# EAGLE design M216X (EAGLE 4.11)
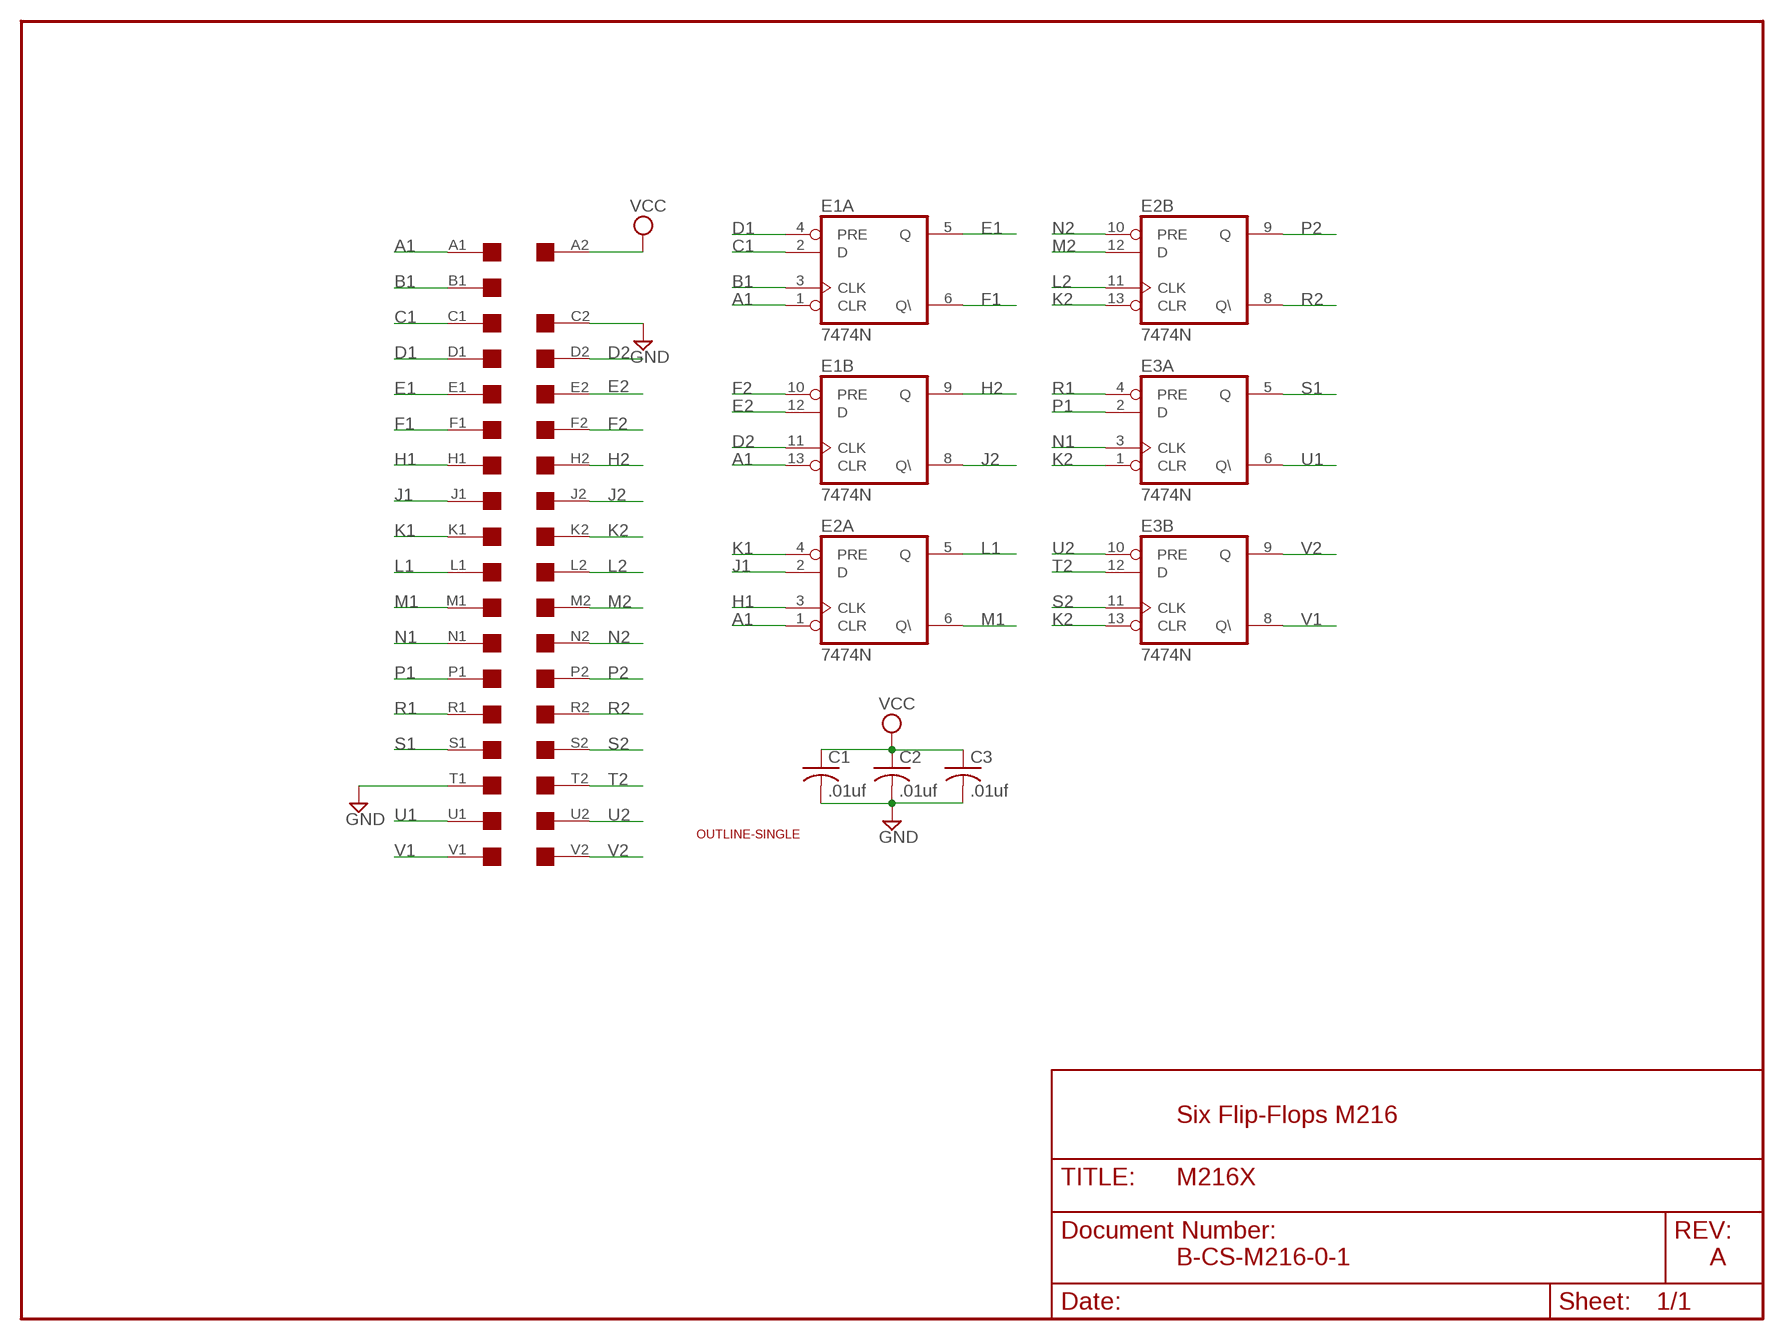
[diagram p0: schematic, sheet 1]

## Parts
C1  .01uf  C-US050-025X075  [C050-025X075]
C2  .01uf  C-US050-025X075  [C050-025X075]
C3  .01uf  C-US050-025X075  [C050-025X075]
E1  7474N  74S74N  [DIL14]
E2  7474N  74S74N  [DIL14]
E3  7474N  74S74N  [DIL14]
U$1  OUTLINE-SINGLE  [SINGLE]
U$4  SINGLE  [EDGE-CON2]

## Nets
A1: E1.1(A:CLR) E1.13(B:CLR) E2.1(A:CLR) U$4.A1
B1: E1.3(A:CLK) U$4.B1
C1: E1.2(A:D) U$4.C1
D1: E1.4(A:PRE) U$4.D1
D2: E1.11(B:CLK) U$4.D2
E1: E1.5(A:Q) U$4.E1
E2: E1.12(B:D) U$4.E2
F1: E1.6(A:Q\) U$4.F1
F2: E1.10(B:PRE) U$4.F2
GND [Supply]: C1.2 C2.2 C3.2 U$4.C2 U$4.T1
H1: E2.3(A:CLK) U$4.H1
H2: E1.9(B:Q) U$4.H2
J1: E2.2(A:D) U$4.J1
J2: E1.8(B:Q\) U$4.J2
K1: E2.4(A:PRE) U$4.K1
K2: E2.13(B:CLR) E3.1(A:CLR) E3.13(B:CLR) U$4.K2
L1: E2.5(A:Q) U$4.L1
L2: E2.11(B:CLK) U$4.L2
M1: E2.6(A:Q\) U$4.M1
M2: E2.12(B:D) U$4.M2
N1: E3.3(A:CLK) U$4.N1
N2: E2.10(B:PRE) U$4.N2
P1: E3.2(A:D) U$4.P1
P2: E2.9(B:Q) U$4.P2
R1: E3.4(A:PRE) U$4.R1
R2: E2.8(B:Q\) U$4.R2
S1: E3.5(A:Q) U$4.S1
S2: E3.11(B:CLK) U$4.S2
T2: E3.12(B:D) U$4.T2
U1: E3.6(A:Q\) U$4.U1
U2: E3.10(B:PRE) U$4.U2
V1: E3.8(B:Q\) U$4.V1
V2: E3.9(B:Q) U$4.V2
VCC [Supply]: C1.1 C2.1 C3.1 U$4.A2
Unconnected: U$4.B2

## Notes on the sheet
- Six Flip-Flops M216
- B-CS-M216-0-1 | A

## Power pins joined to a net without a drawn wire
GND: E1.7(P:GND) E2.7(P:GND) E3.7(P:GND)
VCC: E1.14(P:VCC) E2.14(P:VCC) E3.14(P:VCC)

## Library data of the parts
C1-C3 = rcl:C-US: CAPACITOR, American symbol
E1-E3 = 74xx-us:74*74: Dual D type positive edge triggered FLIP FLOP, preset and clear
U$1 = dec-con:OUTLINE-*: Board outlines for DEC boards.
U$4 = dec-con:SINGLE: Single-Height DEC board

## Net classes
1 Supply: width 0.813 mm

## Board
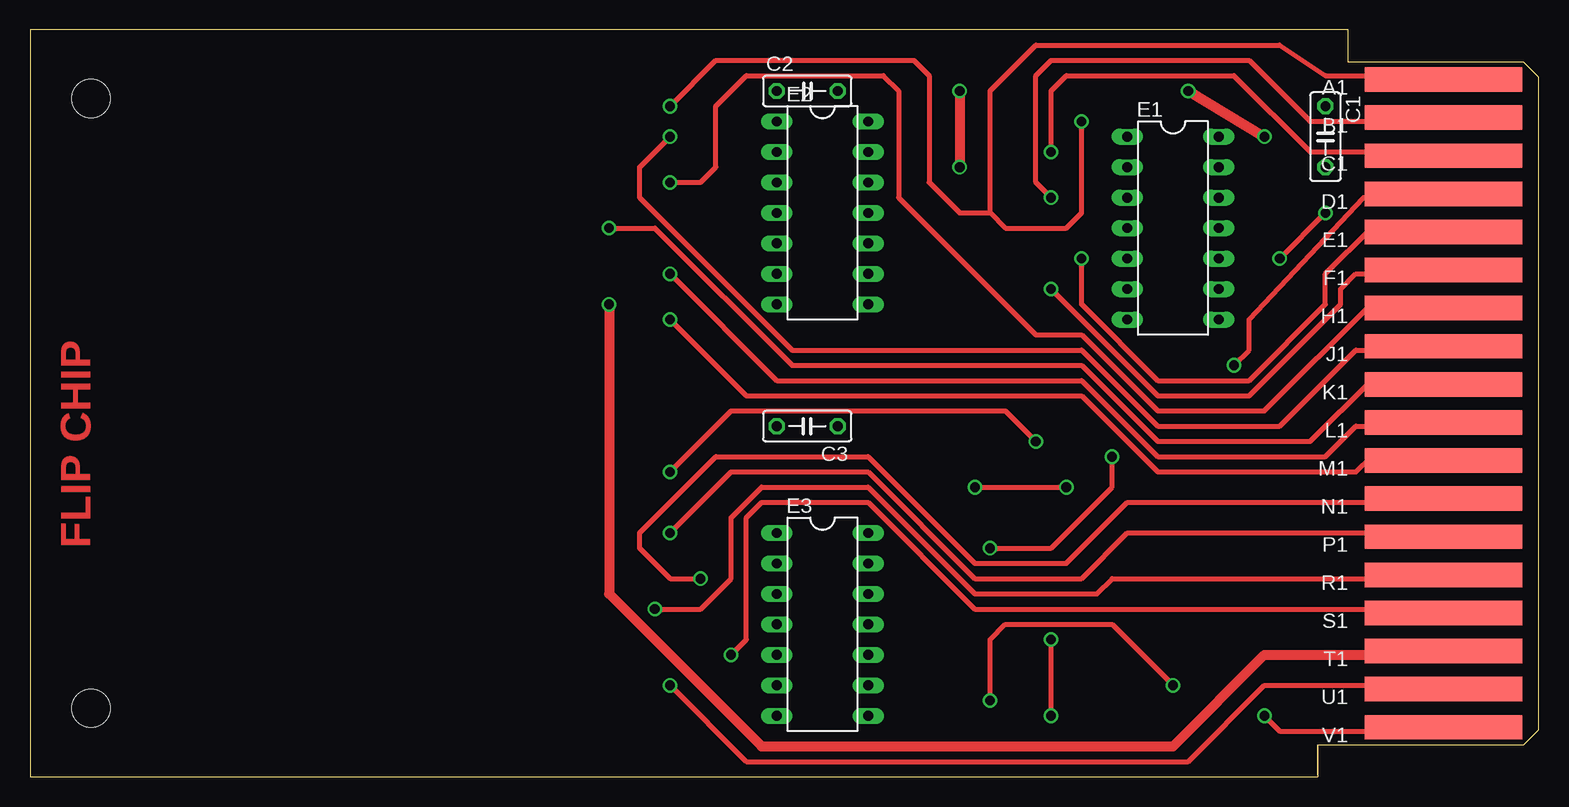
[diagram p1: board, top side]
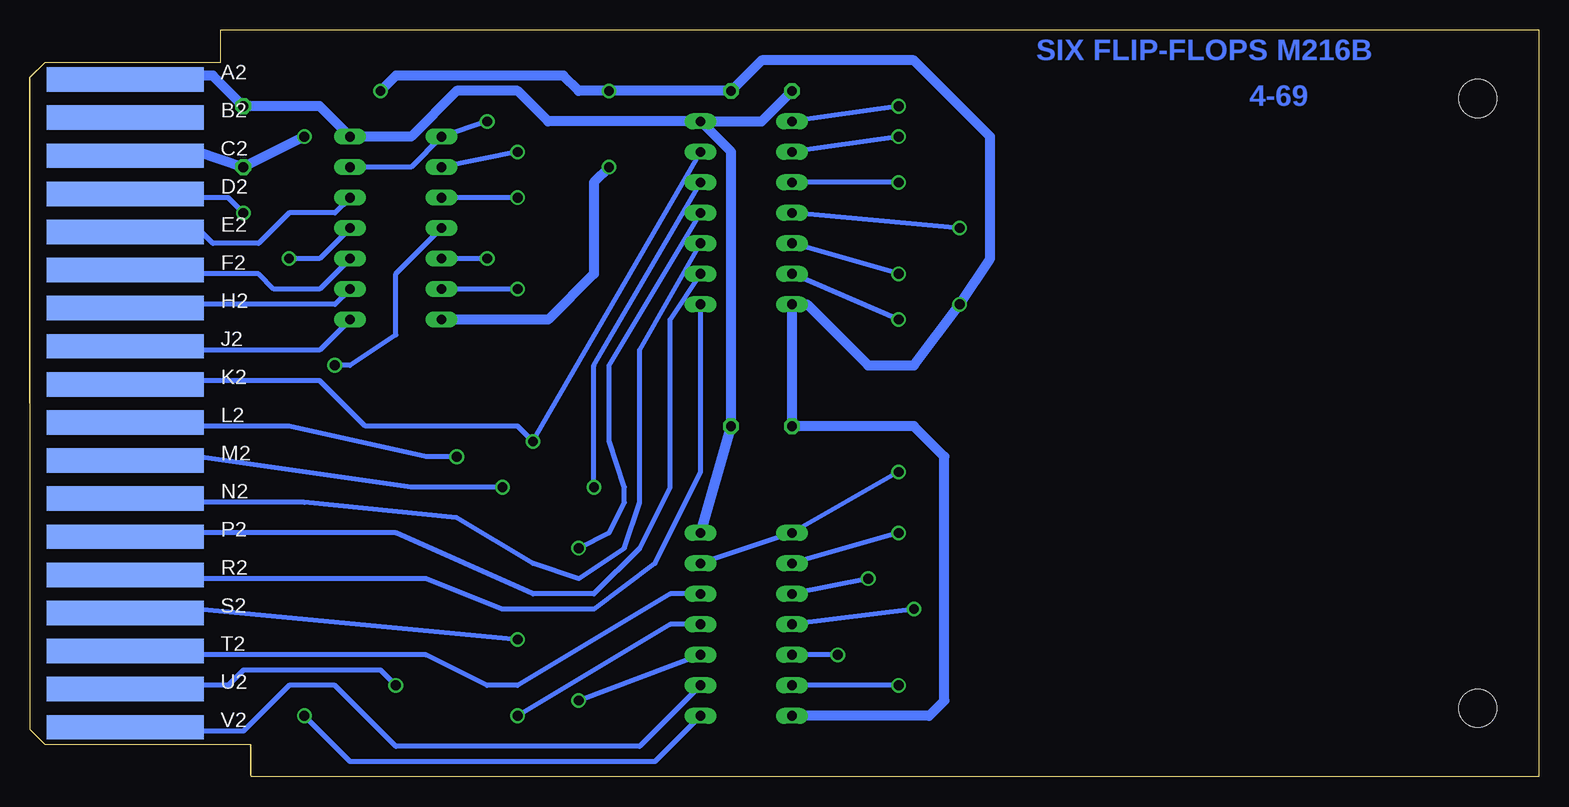
[diagram p2: board, bottom side, seen from below]

Size 125.73 x 62.23 mm. Coordinates in mm from the lower left corner, seen from the top.
Copper layers (1+16): Top 0.035mm / dielectric 1.5mm / Bottom 0.035mm
Design rules "16mils": minimum track width 16mil, minimum drill 32mil, track to track 15mil, track to pad 10mil, pad to pad 10mil, via to via 10mil, smd to smd 10mil, copper to edge 13mil, drill to drill 10mil, minimum pad ring 10mil, minimum via ring 8mil, stop-mask expansion 0mil, vias tented up to drill 0mil, thermal gap 10mil

### Footprints (pad centres in the part's own frame; a part is rotated, then mirrored left to right if it is on the bottom)
C050-025X075 = drill 0.813 octagon: 1 -2.54,0; 2 2.54,0
DIL14 = drill 0.813 long: 1 -7.62,-3.81; 2 -5.08,-3.81; 3 -2.54,-3.81; 4 0,-3.81; 5 2.54,-3.81; 6 5.08,-3.81; 7 7.62,-3.81; 8 7.62,3.81; 9 5.08,3.81; 10 2.54,3.81; 11 0,3.81; 12 -2.54,3.81; 13 -5.08,3.81; 14 -7.62,3.81
SINGLE = hole 3.175: 120.65,56.515; 120.65,5.715
EDGE-CON2 = smd 13.106 x 2.032: A1 7.938,4.128; B1 7.938,7.303; C1 7.938,10.477; D1 7.938,13.652; E1 7.938,16.828; F1 7.938,20.003; H1 7.938,23.177; J1 7.938,26.352; K1 7.938,29.527; L1 7.938,32.703; M1 7.938,35.877; N1 7.938,39.053; P1 7.938,42.227; R1 7.938,45.403; S1 7.938,48.578; T1 7.938,51.752; U1 7.938,54.928; V1 7.938,58.102 | smd 13.106 x 2.032 bottom: A2 7.938,4.128; B2 7.938,7.303; C2 7.938,10.477; D2 7.938,13.652; E2 7.938,16.828; F2 7.938,20.003; H2 7.938,23.177; J2 7.938,26.352; K2 7.938,29.527; L2 7.938,32.703; M2 7.938,35.877; N2 7.938,39.053; P2 7.938,42.227; R2 7.938,45.403; S2 7.938,48.578; T2 7.938,51.752; U2 7.938,54.928; V2 7.938,58.102

### Placement (x,y rotation side)
C1  107.95,53.34 270 top
C2  64.77,57.15 0 top
C3  64.77,29.21 180 top
E1  95.25,45.72 270 top
E2  66.04,46.99 270 top
E3  66.04,12.7 270 top
U$1  125.73,62.23 180 top
U$4  125.73,62.23 180 top
U$5  [FLIPCHIP]  0,0 0 top

### Tracks (layer width: path | path; a pad name or v marks a point on that pad's centre or on a via)
A1  (via drill 0.81)
  Top 0.406: U$4.A1 117.24,58.02 116.84,58.42 107.95,58.42 104.14,60.96 83.82,60.96 80.01,57.15 80.01,46.99 | 80.01,46.99 81.28,45.72 86.36,45.72 87.63,46.99 v87.63,54.61 | v53.34,55.88 57.15,59.69 73.66,59.69 74.93,58.42 74.93,49.53 77.47,46.99 80.01,46.99
  Bottom 0.406: v53.34,55.88 E2.1 | E1.13 93.98,50.8 E1.1 v87.63,54.61
B1  (via drill 0.81)
  Top 0.406: U$4.B1 117.13,54.9 116.84,54.61 106.68,54.61 101.6,59.69 85.09,59.69 83.82,58.42 83.82,49.53 v85.09,48.26
  Bottom 0.406: v85.09,48.26 E1.3
C1  (via drill 0.81)
  Top 0.406: U$4.C1 117.17,51.74 116.84,52.07 106.68,52.07 100.33,58.42 86.36,58.42 85.09,57.15 v85.09,52.07
  Bottom 0.406: v85.09,52.07 E1.2
D1  (via drill 0.81)
  Top 0.406: U$4.D1 117.14,48.56 116.84,48.26 111.12,48.26 101.6,38.1 101.6,35.56 v100.33,34.29
  Bottom 0.406: E1.4 95.25,41.91 95.25,36.83 99.06,34.29 v100.33,34.29
D2  (via drill 0.81)
  Top 0.406: v104.14,43.18 v107.95,46.99
  Bottom 0.406: E1.11 101.6,43.18 v104.14,43.18 | U$4.D2 117.14,48.56 116.84,48.26 109.22,48.26 v107.95,46.99
E1  (via drill 0.81)
  Top 0.406: U$4.E1 117.17,45.39 116.84,45.72 111.76,45.72 107.95,41.91 107.95,39.37 101.6,33.02 93.98,33.02 87.63,39.37 v87.63,43.18
  Bottom 0.406: v87.63,43.18 E1.5
E2
  Bottom 0.406: U$4.E2 115.9,45.39 115.57,45.72 111.76,45.72 110.49,44.45 106.68,44.45 104.14,46.99 100.33,46.99 E1.12
F1  (via drill 0.81)
  Top 0.406: U$4.F1 117.12,42.19 116.84,41.91 110.49,41.91 109.22,40.64 109.22,39.37 101.6,31.75 93.98,31.75 v85.09,40.64
  Bottom 0.406: v85.09,40.64 E1.6
F2
  Bottom 0.406: U$4.F2 117.12,42.19 116.84,41.91 106.68,41.91 105.41,40.64 101.6,40.64 E1.10
GND  (via drill 0.81)
  Top 0.813: v77.47,57.15 v77.47,50.8 | U$4.T1 117.17,10.49 116.84,10.16 102.87,10.16 95.25,2.54 60.96,2.54 48.26,15.24 v48.26,39.37 | v96.52,57.15 v102.87,53.34
  Bottom 0.813: v96.52,57.15 95.25,58.42 81.28,58.42 80.01,57.15 v77.47,57.15 C2.2 64.77,59.69 52.07,59.69 45.72,53.34 45.72,43.18 v48.26,39.37 52.07,34.29 55.88,34.29 60.96,39.37 E2.7 C3.2 52.07,29.21 49.53,26.67 49.53,6.35 50.8,5.08 E3.7 | E1.7 82.55,38.1 78.74,41.91 78.74,49.53 v77.47,50.8 | U$4.C2 116.84,52.07 111.76,52.07 C1.2 v102.87,53.34
H1  (via drill 0.81)
  Top 0.406: v53.34,49.53 55.88,49.53 57.15,50.8 57.15,55.88 59.69,58.42 71.12,58.42 72.39,57.15 72.39,48.26 83.82,36.83 87.63,36.83 93.98,30.48 102.87,30.48 111.76,39.37 116.84,39.37 117.17,39.04 U$4.H1
  Bottom 0.406: v53.34,49.53 E2.3
H2
  Bottom 0.406: U$4.H2 117.17,39.04 116.84,39.37 100.33,39.37 E1.9
J1  (via drill 0.81)
  Top 0.406: U$4.J1 115.9,35.89 115.57,35.56 110.49,35.56 104.14,29.21 93.98,29.21 87.63,35.56 63.5,35.56 50.8,48.26 50.8,50.8 v53.34,53.34
  Bottom 0.406: v53.34,53.34 E2.2
J2
  Bottom 0.406: U$4.J2 115.57,35.56 101.6,35.56 E1.8
K1  (via drill 0.81)
  Top 0.406: U$4.K1 117.14,32.72 116.84,33.02 111.76,33.02 106.68,27.94 93.98,27.94 87.63,34.29 63.5,34.29 52.07,45.72 v48.26,45.72
  Bottom 0.406: v48.26,45.72 E2.4
K2  (via drill 0.81)
  Top 0.406: v83.82,27.94 81.28,30.48 58.42,30.48 v53.34,25.4
  Bottom 0.406: U$4.K2 117.14,32.72 116.84,33.02 101.6,33.02 97.79,29.21 85.09,29.21 v83.82,27.94 E2.13 | v53.34,25.4 E3.1 E3.13
L1  (via drill 0.81)
  Top 0.406: U$4.L1 115.9,29.54 115.57,29.21 110.49,29.21 107.95,26.67 93.98,26.67 87.63,33.02 62.23,33.02 v53.34,41.91
  Bottom 0.406: v53.34,41.91 E2.5
L2  (via drill 0.81)
  Top 0.406: v80.01,19.05 85.09,19.05 90.17,24.13 v90.17,26.67
  Bottom 0.406: E2.11 77.47,34.29 77.47,27.94 76.2,24.13 76.2,22.86 77.47,20.32 v80.01,19.05 | U$4.L2 116.84,29.21 104.14,29.21 92.71,26.67 v90.17,26.67
M1  (via drill 0.81)
  Top 0.406: U$4.M1 115.9,26.34 115.57,26.67 111.76,26.67 110.49,25.4 93.98,25.4 87.63,31.75 59.69,31.75 v53.34,38.1
  Bottom 0.406: v53.34,38.1 E2.6
M2  (via drill 0.81)
  Top 0.406: v78.74,24.13 v86.36,24.13
  Bottom 0.406: E2.12 78.74,34.29 v78.74,24.13 | U$4.M2 115.57,26.67 111.76,26.67 93.98,24.13 v86.36,24.13
N1  (via drill 0.81)
  Top 0.406: U$4.N1 117.17,23.19 116.84,22.86 91.44,22.86 86.36,17.78 78.74,17.78 69.85,26.67 57.15,26.67 50.8,20.32 50.8,19.05 53.34,16.51 v55.88,16.51
  Bottom 0.406: v55.88,16.51 E3.3
N2
  Bottom 0.406: E2.10 74.93,35.56 74.93,22.86 76.2,19.05 80.01,16.51 83.82,17.78 90.17,21.59 102.87,22.86 116.84,22.86 116.84,23.19 U$4.N2
P1  (via drill 0.81)
  Top 0.406: U$4.P1 115.9,19.99 115.57,20.32 91.44,20.32 87.63,16.51 78.74,16.51 69.85,25.4 58.42,25.4 v53.34,20.32
  Bottom 0.406: v53.34,20.32 E3.2
P2
  Bottom 0.406: E2.9 72.39,38.1 72.39,24.13 74.93,19.05 78.74,15.24 83.82,15.24 95.25,20.32 116.84,20.32 117.17,19.99 U$4.P2
R1  (via drill 0.81)
  Top 0.406: U$4.R1 115.9,16.84 115.57,16.51 90.17,16.51 88.9,15.24 78.74,15.24 69.85,24.13 60.96,24.13 58.42,21.59 58.42,16.51 55.88,13.97 v52.07,13.97
  Bottom 0.406: v52.07,13.97 E3.4
R2
  Bottom 0.406: E2.8 69.85,25.4 73.66,17.78 78.74,13.97 86.36,13.97 92.71,16.51 115.57,16.51 U$4.R2
S1  (via drill 0.81)
  Top 0.406: U$4.S1 114.61,13.66 114.3,13.97 78.74,13.97 69.85,22.86 60.96,22.86 59.69,21.59 59.69,11.43 v58.42,10.16
  Bottom 0.406: v58.42,10.16 E3.5
S2  (via drill 0.81)
  Top 0.406: v85.09,5.08 v85.09,11.43
  Bottom 0.406: E3.11 72.39,12.7 v85.09,5.08 | U$4.S2 116.84,13.97 111.76,13.97 v85.09,11.43
T2
  Bottom 0.406: E3.12 72.39,15.24 85.09,7.62 87.63,7.62 92.71,10.16 116.84,10.16 U$4.T2
U1  (via drill 0.81)
  Top 0.406: U$4.U1 117.2,7.26 116.84,7.62 102.87,7.62 96.52,1.27 59.69,1.27 v53.34,7.62
  Bottom 0.406: v53.34,7.62 E3.6
U2  (via drill 0.81)
  Top 0.406: v80.01,6.35 80.01,11.43 81.28,12.7 90.17,12.7 v95.25,7.62
  Bottom 0.406: E3.10 v80.01,6.35 | U$4.U2 116.84,7.62 109.22,7.62 107.95,8.89 96.52,8.89 v95.25,7.62
V1  (via drill 0.81)
  Top 0.406: U$4.V1 117.23,4.2 116.84,3.81 104.14,3.81 v102.87,5.08
  Bottom 0.406: E3.8 73.66,1.27 99.06,1.27 v102.87,5.08
V2
  Bottom 0.406: U$4.V2 115.96,4.2 115.57,3.81 107.95,3.81 104.14,7.62 100.33,7.62 95.25,2.54 74.93,2.54 E3.9
VCC
  Bottom 0.813: U$4.A2 116.84,58.42 110.49,58.42 C1.1 101.6,55.88 E1.14 93.98,53.34 90.17,57.15 85.09,57.15 82.55,54.61 E2.14 | C2.1 64.77,54.61 E2.14 | E2.14 67.31,52.07 C3.1 E3.14

### Text on the board
Bottom: SIX FLIP-FLOPS M216B | 4-69